# EAGLE design pic to fox (EAGLE 4.16)
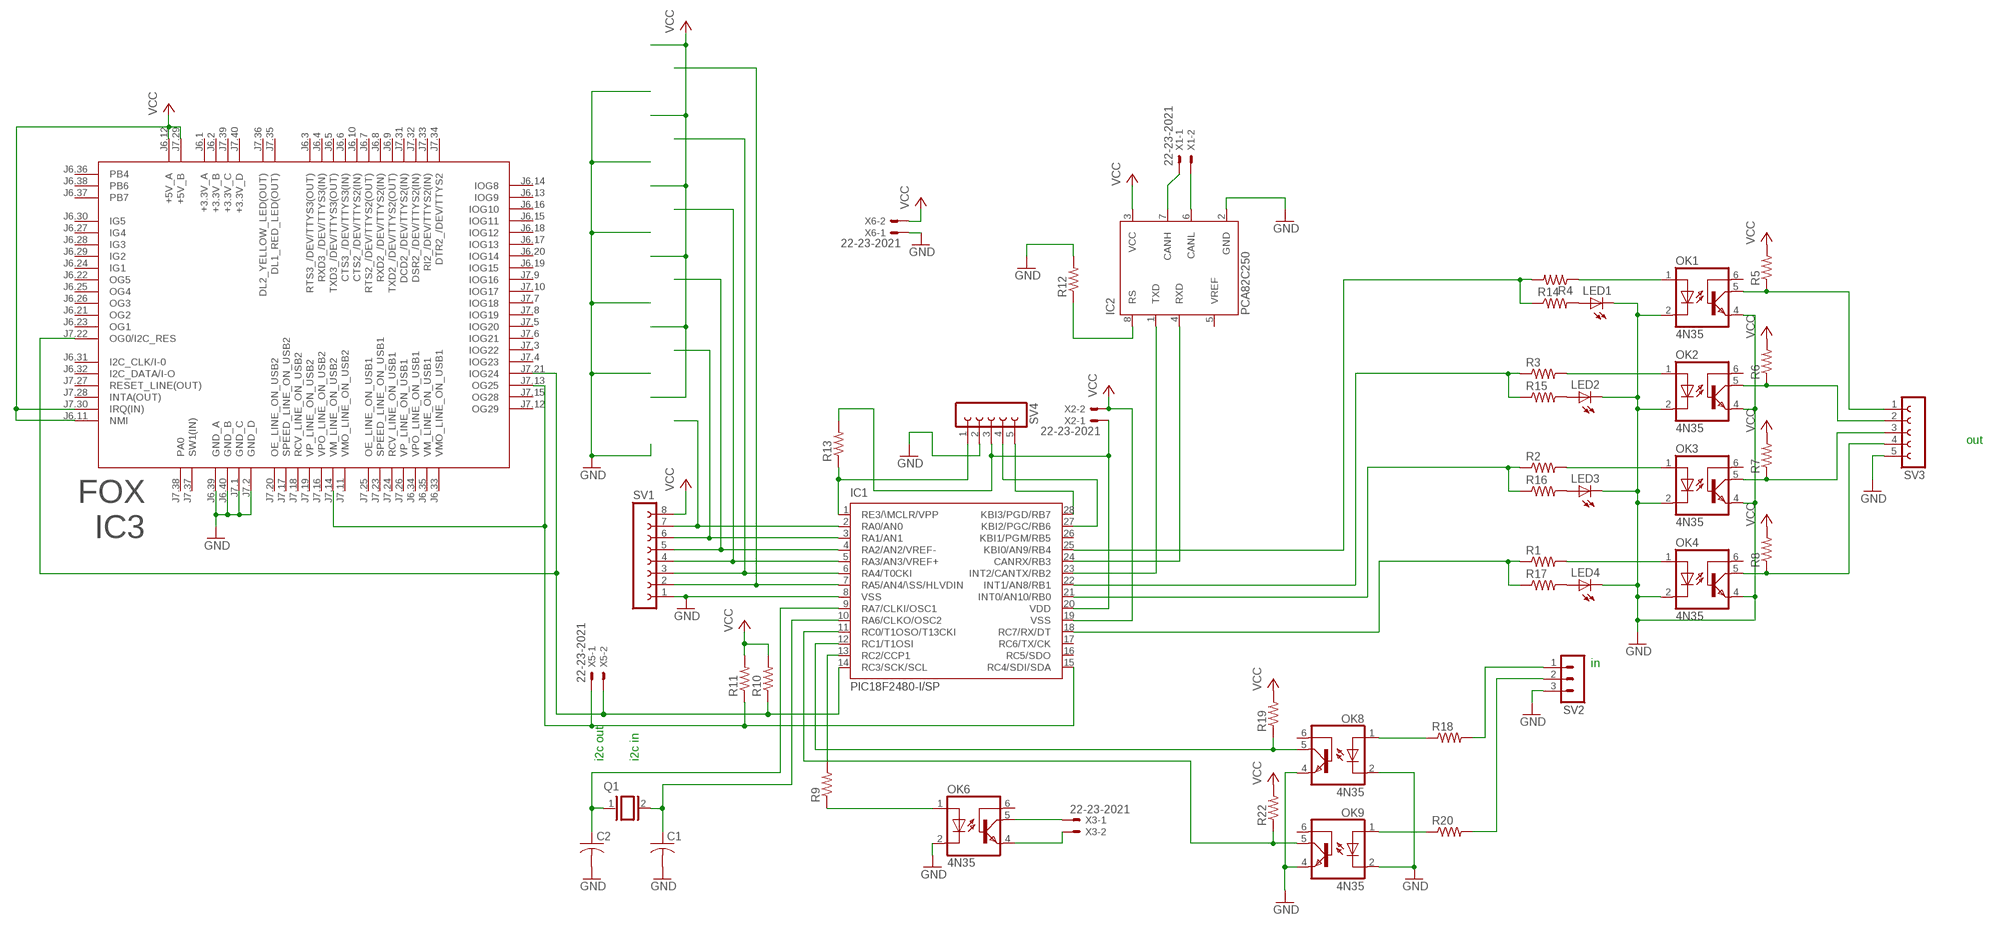
[diagram p0: schematic, sheet 1]

## Parts
C1  C-US025-030X050  [C025-030X050]
C2  C-US025-030X050  [C025-030X050]
IC1  PIC18F2480-I/SP  [DIL28-3]
IC2  PCA82C250  [DIL08]
IC3  FOX  [FOX]
LED1  LEDCHIP-LED0805  [CHIP-LED0805]
LED2  LEDCHIP-LED0805  [CHIP-LED0805]
LED3  LEDCHIP-LED0805  [CHIP-LED0805]
LED4  LEDCHIP-LED0805  [CHIP-LED0805]
OK1  4N35  [DIL06]
OK2  4N35  [DIL06]
OK3  4N35  [DIL06]
OK4  4N35  [DIL06]
OK6  4N35  [DIL06]
OK8  4N35  [DIL06]
OK9  4N35  [DIL06]
Q1  XTAL  [Q]
R1  R-US_0207/5V  [0207/5V]
R2  R-US_0207/2V  [0207/2V]
R3  R-US_0207/2V  [0207/2V]
R4  R-US_0207/10  [0207/10]
R5  R-US_0207/2V  [0207/2V]
R6  R-US_0207/12  [0207/12]
R7  R-US_0207/2V  [0207/2V]
R8  R-US_0207/2V  [0207/2V]
R9  R-US_0207/2V  [0207/2V]
R10  R-US_0207/2V  [0207/2V]
R11  R-US_0207/2V  [0207/2V]
R12  R-US_0207/10  [0207/10]
R13  R-US_0207/5V  [0207/5V]
R14  R-US_0207/10  [0207/10]
R15  R-US_0207/2V  [0207/2V]
R16  R-US_0207/2V  [0207/2V]
R17  R-US_0207/2V  [0207/2V]
R18  R-US_0207/10  [0207/10]
R19  R-US_0207/2V  [0207/2V]
R20  R-US_0207/10  [0207/10]
R22  R-US_0207/5V  [0207/5V]
SV1  FE08-1  [FE08]
SV2  MA03-1  [MA03-1]
SV3  FE05-1  [FE05-1]
SV4  FE05-1  [FE05-1]
X1  22-23-2021  [22-23-2021]
X2  22-23-2021  [22-23-2021]
X3  22-23-2021  [22-23-2021]
X5  22-23-2021  [22-23-2021]
X6  22-23-2021  [22-23-2021]

## Nets
GND: C1.2 C2.2 IC1.8(VSS) IC2.2(GND) IC3.J6.39(GND_A) IC3.J6.40(GND_B) IC3.J7.1(GND_C) IC3.J7.2(GND_D) LED1.C LED2.C LED3.C LED4.C OK1.2(C) OK1.4(EMI) OK2.2(C) OK2.4(EMI) OK3.2(C) OK3.4(EMI) OK4.2(C) OK4.4(EMI) OK6.2(C) OK8.2(C) OK8.4(EMI) OK9.2(C) OK9.4(EMI) R12.2 SV1.1 SV2.3 SV3.5 SV4.2 X6.1
N$1: IC1.2(RA0/AN0) SV1.7
N$2: IC1.3(RA1/AN1) SV1.6
N$3: IC1.4(RA2/AN2/VREF-) SV1.5
N$4: IC1.5(RA3/AN3/VREF+) SV1.4
N$5: IC1.6(RA4/T0CKI) SV1.3
N$6: OK4.1(A) R1.2
N$7: IC1.11(RC0/T1OSO/T13CKI) OK9.5(COL) R22.1
N$8: LED1.A R14.2
N$9: LED3.A R16.2
N$10: IC1.7(RA5/AN4/\SS/HLVDIN) SV1.2
N$11: IC1.15(RC4/SDI/SDA) IC3.J7.13(OG25) IC3.J7.14(VM_LINE_ON_USB2) R11.1 X5.1
N$12: IC1.14(RC3/SCK/SCL) IC3.J7.21(IOG24) IC3.J7.22(OG0/I2C_RES) R10.1 X5.2
N$13: OK3.1(A) R2.2
N$14: OK2.1(A) R3.2
N$15: OK1.1(A) R4.1
N$16: OK3.5(COL) R7.1 SV3.3
N$17: OK4.5(COL) R8.1 SV3.4
N$18: OK2.5(COL) R6.1 SV3.2
N$19: OK1.5(COL) R5.1 SV3.1
N$20: LED4.A R17.2
N$21: IC1.13(RC2/CCP1) R9.2
N$22: OK6.1(A) R9.1
N$23: IC1.23(INT2/CANTX/RB2) IC2.1(TXD)
N$24: C1.1 IC1.10(RA6/CLKO/OSC2) Q1.2
N$25: C2.1 IC1.9(RA7/CLKI/OSC1) Q1.1
N$26: LED2.A R15.2
N$27: IC1.12(RC1/T1OSI) OK8.5(COL) R19.1
N$29: IC1.24(CANRX/RB3) IC2.4(RXD)
N$31: IC2.6(CANL) X1.2
N$32: IC2.7(CANH) X1.1
N$33: IC2.8(RS) R12.1
N$37: IC1.1(RE3/\MCLR/VPP) R13.1 SV4.1
N$38: IC1.20(VDD) R13.2 SV4.3 X2.1
N$39: IC1.27(KBI2/PGC/RB6) SV4.4
N$40: OK8.1(A) R18.1
N$41: IC1.25(KBI0/AN9/RB4) R4.2 R14.1
N$42: IC1.22(INT1/AN8/RB1) R3.1 R15.1
N$43: IC1.21(INT0/AN10/RB0) R2.1 R16.1
N$44: IC1.18(RC7/RX/DT) R1.1 R17.1
N$45: OK9.1(A) R20.1
N$47: OK6.5(COL) X3.1
N$48: OK6.4(EMI) X3.2
N$52: R18.2 SV2.1
N$53: R20.2 SV2.2
N$54: IC1.28(KBI3/PGD/RB7) SV4.5
VCC: IC1.19(VSS) IC2.3(VCC) IC3.J6.11(NMI) IC3.J6.12(+5V_A) IC3.J7.29(+5V_B) IC3.J7.30(IRQ(IN)) R5.2 R6.2 R7.2 R8.2 R10.2 R11.2 R19.2 R22.2 SV1.8 X2.2 X6.2
Unconnected: IC1.16(RC5/SDO) IC1.17(RC6/TX/CK) IC1.26(KBI1/PGM/RB5) IC2.5(VREF) IC3.J6.1(+3.3V_A) IC3.J6.2(+3.3V_B) IC3.J6.3(RTS3_/DEV/TTYS3(OUT)) IC3.J6.4(RXD3_/DEV/TTYS3(IN)) IC3.J6.5(TXD3_/DEV/TTYS3(OUT)) IC3.J6.6(CTS3_/DEV/TTYS3(IN)) IC3.J6.7(RTS2_/DEV/TTYS2(OUT)) IC3.J6.8(RXD2_/DEV/TTYS2(IN)) IC3.J6.9(TXD2_/DEV/TTYS2(OUT)) IC3.J6.10(CTS2_/DEV/TTYS2(IN)) IC3.J6.13(IOG9) IC3.J6.14(IOG8) IC3.J6.15(IOG11) IC3.J6.16(IOG10) IC3.J6.17(IOG13) IC3.J6.18(IOG12) IC3.J6.19(IOG15) IC3.J6.20(IOG14) IC3.J6.21(OG2) IC3.J6.22(OG5) IC3.J6.23(OG1) IC3.J6.24(IG1) IC3.J6.25(OG4) IC3.J6.26(OG3) IC3.J6.27(IG4) IC3.J6.28(IG3) IC3.J6.29(IG2) IC3.J6.30(IG5) IC3.J6.31(I2C_CLK/I-0) IC3.J6.32(I2C_DATA/I-O) IC3.J6.33(VMO_LINE_ON_USB1) IC3.J6.34(VPO_LINE_ON_USB1) IC3.J6.35(VM_LINE_ON_USB1) IC3.J6.36(PB4) IC3.J6.37(PB7) IC3.J6.38(PB6) IC3.J7.3(IOG22) IC3.J7.4(IOG23) IC3.J7.5(IOG20) IC3.J7.6(IOG21) IC3.J7.7(IOG18) IC3.J7.8(IOG19) IC3.J7.9(IOG16) IC3.J7.10(IOG17) IC3.J7.11(VMO_LINE_ON_USB2) IC3.J7.12(OG29) IC3.J7.15(OG28) IC3.J7.16(VPO_LINE_ON_USB2) IC3.J7.17(SPEED_LINE_ON_USB2) IC3.J7.18(RCV_LINE_ON_USB2) IC3.J7.19(VP_LINE_ON_USB2) IC3.J7.20(OE_LINE_ON_USB2) IC3.J7.23(SPEED_LINE_ON_USB1) IC3.J7.24(RCV_LINE_ON_USB1) IC3.J7.25(OE_LINE_ON_USB1) IC3.J7.26(VP_LINE_ON_USB1) IC3.J7.27(RESET_LINE(OUT)) IC3.J7.28(INTA(OUT)) IC3.J7.31(DCD2_/DEV/TTYS2(IN)) IC3.J7.32(DSR2_/DEV/TTYS2(IN)) IC3.J7.33(RI2_/DEV/TTYS2(IN)) IC3.J7.34(DTR2_/DEV/TTYS2) IC3.J7.35(DL1_RED_LED(OUT)) IC3.J7.36(DL2_YELLOW_LED(OUT)) IC3.J7.37(SW1(IN)) IC3.J7.38(PA0) IC3.J7.39(+3.3V_C) IC3.J7.40(+3.3V_D) OK1.6(BAS) OK2.6(BAS) OK3.6(BAS) OK4.6(BAS) OK6.6(BAS) OK8.6(BAS) OK9.6(BAS)

## Notes on the sheet
- out
- in
- i2c out | i2c in

## Library data of the parts
C1 C2 = rcl:C-US: CAPACITOR, American symbol
IC1 = microchip:PIC18F2*80: 28-Pin Enhanced Flash Microcontrollers with ECAN(TM) Technology 10-Bit A/D and nanoWatt Technology Source: http://www.microchip.com .. 39637a.pdf
IC2 = micro-philips:PCA82C250: CAN CONTROLLER INTERFACE
IC3 = aggiunte:FOX: FOXBOARD Un sistema linux embedded completo www.acmesystem.it
LED1-LED4 = led:LED: LED OSRAM: - CHIPLED LG R971, LG N971, LY N971, LG Q971, LY Q971, LO R971, LY R971 LH N974, LH R974 LS Q976, LO Q976, LY Q976 LO Q996 - Hyper CHIPLED LW Q18S LB Q993, LB Q99A, LB R99A - SideLED LS A670, LO A670, LY A670, LG A670, LP A670 LB A673, LV A673, LT A673, LW A673 LH A674 LY A675 LS A676, LA A676, LO A676, LY A676, LW A676 LS A679, LY A679, LG A679 - Hyper Micro SIDELED® LS Y876, LA Y876, LO Y876, LY Y876 LT Y87S - SmartLED LW L88C, LW L88S LB L89C, LB L89S, LG L890 LS L89K, LO L89K, LY L89K LS L896, LA L896, LO L896, LY L896 - TOPLED LS T670, LO T670, LY T670, LG T670, LP T670 LSG T670, LSP T670, LSY T670, LOP T670, LYG T670 LG T671, LOG T671, LSG T671 LB T673, LV T673, LT T673, LW T673 LH T674 LS T676, LA T676, LO T676, LY T676, LB T676, LH T676, LSB T676, LW T676 LB T67C, LV T67C, LT T67C, LS T67K, LO T67K, LY T67K, LW E67C LS E67B, LA E67B, LO E67B, LY E67B, LB E67C, LV E67C, LT E67C LW T67C LS T679, LY T679, LG T679 LS T770, LO T770, LY T770, LG T770, LP T770 LB T773, LV T773, LT T773, LW T773 LH T774 LS E675, LA E675, LY E675, LS T675 LS T776, LA T776, LO T776, LY T776, LB T776 LHGB T686 LT T68C, LB T68C - Hyper Mini TOPLED® LB M676 - Mini TOPLED Santana® LG M470 LS M47K, LO M47K, LY M47K Source: http://www.osram.convergy.de - LUMILED® LXK2-PW12-R00, LXK2-PW12-S00, LXK2-PW14-U00, LXK2-PW14-V00 LXK2-PM12-R00, LXK2-PM12-S00, LXK2-PM14-U00 LXK2-PE12-Q00, LXK2-PE12-R00, LXK2-PE12-S00, LXK2-PE14-T00, LXK2-PE14-U00 LXK2-PB12-K00, LXK2-PB12-L00, LXK2-PB12-M00, LXK2-PB14-N00, LXK2-PB14-P00, LXK2-PB14-Q00 LXK2-PR12-L00, LXK2-PR12-M00, LXK2-PR14-Q00, LXK2-PR14-R00 LXK2-PD12-Q00, LXK2-PD12-R00, LXK2-PD12-S00 LXK2-PH12-R00, LXK2-PH12-S00 LXK2-PL12-P00, LXK2-PL12-Q00, LXK2-PL12-R00 Source: www.luxeon.com
OK1-OK4 OK6 OK8 OK9 = optocoupler:4N35: MOTOROLA OPTO COUPLER
Q1 = special:XTAL: CRYSTAL
R1-R20 R22 = rcl:R-US_: RESISTOR, American symbol
SV1 = con-lsta:FE08-1: FEMALE HEADER
SV2 = con-lstb:MA03-1: PIN HEADER
SV3 SV4 = con-lsta:FE05-1: FEMALE HEADER
X1-X3 X5 X6 = con-molex:22-23-2021: .100" (2.54mm) Center Header - 2 Pin

## Board
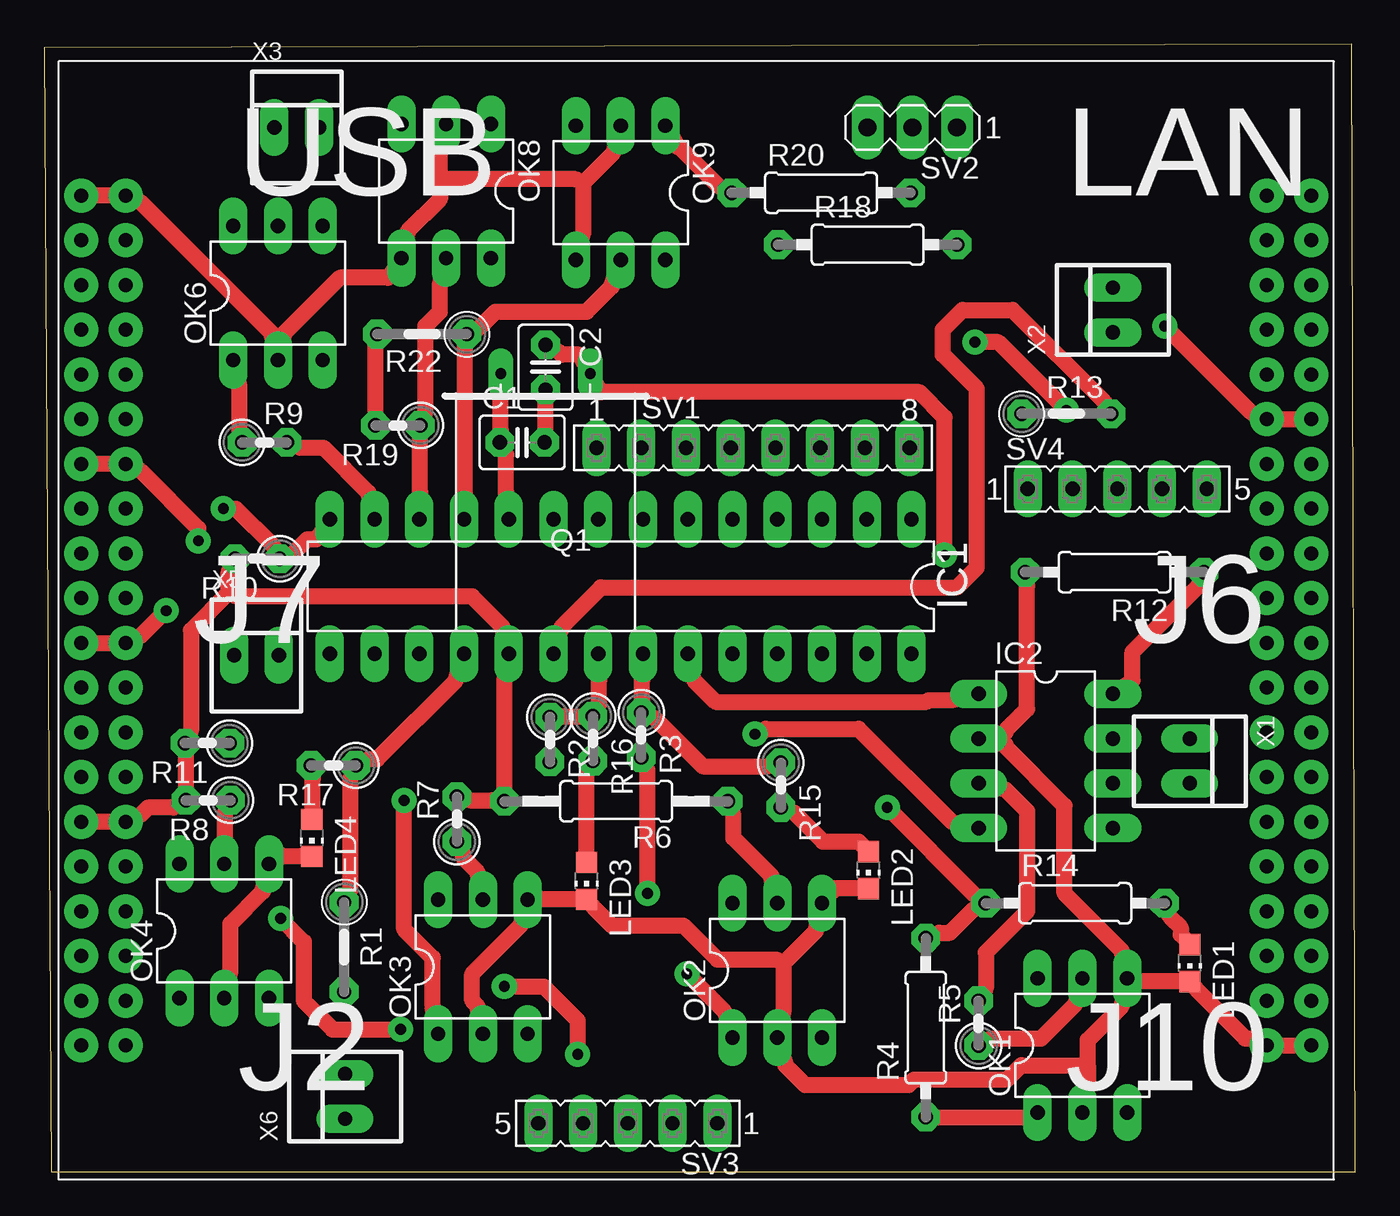
[diagram p1: board, top side]
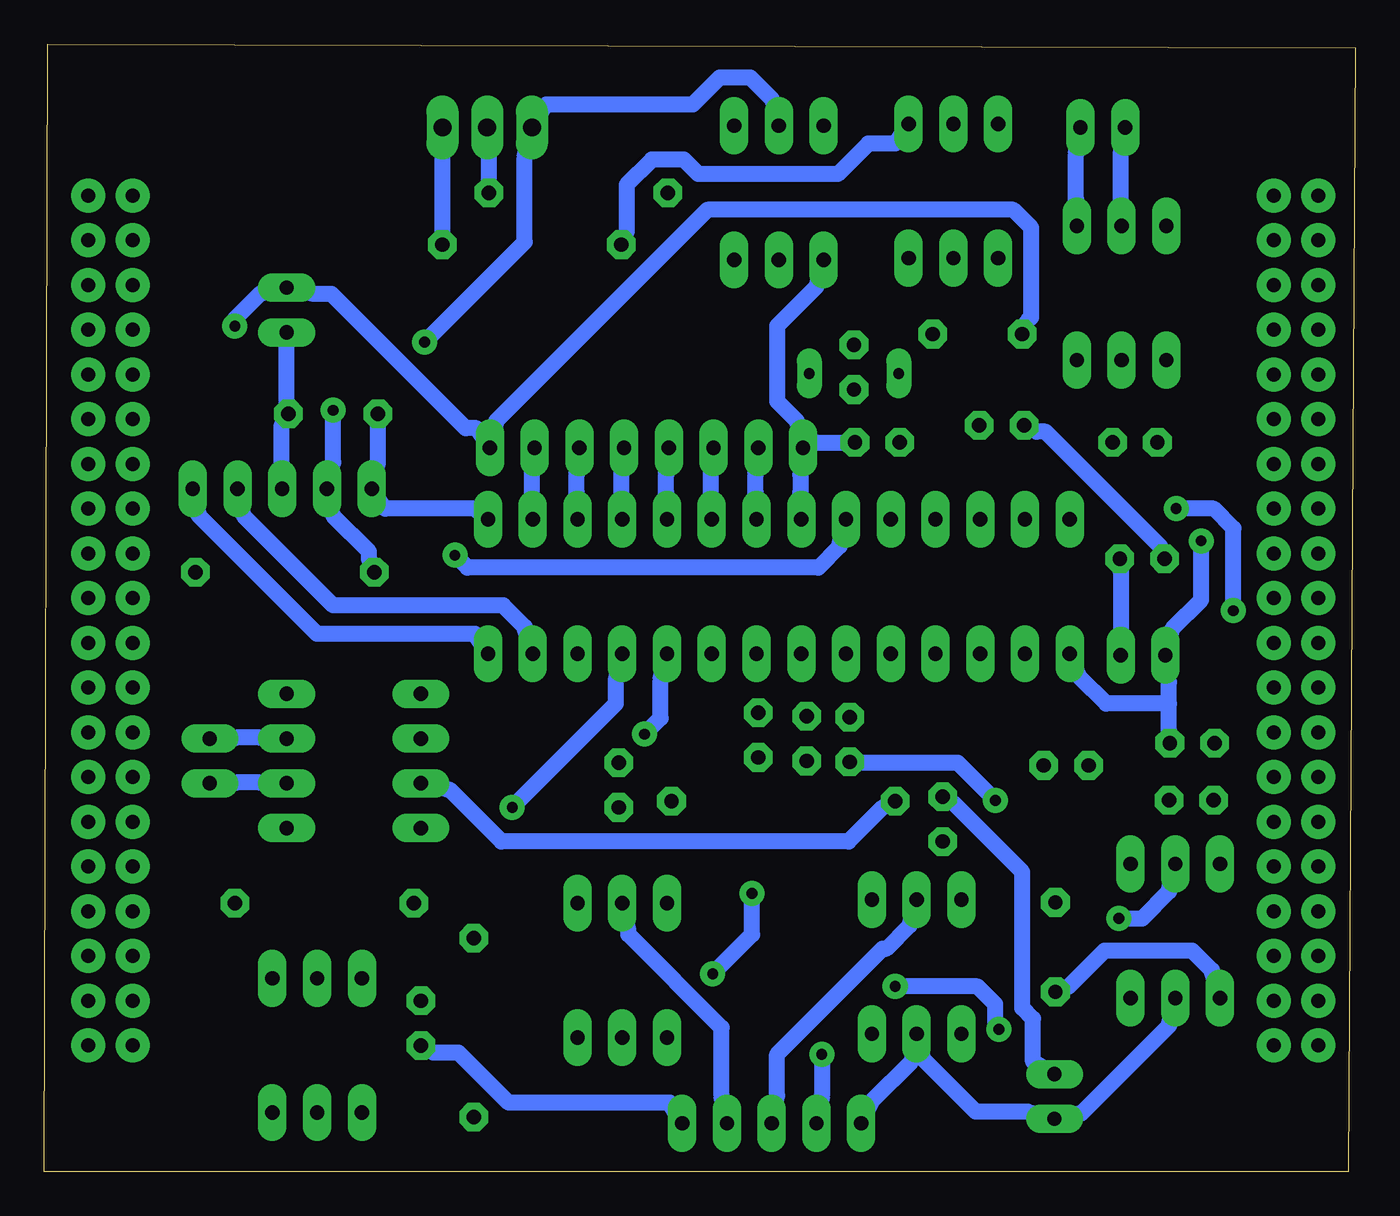
[diagram p2: board, bottom side, seen from below]

Size 74.45 x 64.03 mm. Coordinates in mm from the lower left corner, seen from the top.
Outline: 0.41,0 74.45,0 74.25,64.03 0,63.83 0.41,0
Copper layers (1*16): Top 0.035mm / dielectric 1.5mm / Bottom 0.035mm
Design rules "mio2": minimum track width 36mil, minimum drill 24mil, track to track 24mil, track to pad 24mil, pad to pad 24mil, via to via 24mil, smd to smd 24mil, copper to edge 24mil, drill to drill 8mil, minimum pad ring 16mil, minimum via ring 16mil, stop-mask expansion 4mil, vias tented up to drill 0mil, thermal gap 10mil
tRestrict: area 27.2,1.1 to 39.2,4.3; area 54.5,37.2 to 67.1,40.5; area 63.4,21.2 to 66.5,25.5; area 30.3,39.5 to 50,42.9; area 58.9,47 to 62.2,51.1; area 45.7,57.4 to 52.9,61.2; area 12.2,57.8 to 16.5,61; area 10,27.7 to 14,30.9; area 15.5,2.3 to 18.7,6.4

### Footprints (pad centres in the part's own frame; a part is rotated, then mirrored left to right if it is on the bottom)
C025-030X050 = drill 0.813 octagon: 1 -1.27,0; 2 1.27,0
DIL28-3 = drill 0.813 long: 1 -16.51,-3.81; 2 -13.97,-3.81; 3 -11.43,-3.81; 4 -8.89,-3.81; 5 -6.35,-3.81; 6 -3.81,-3.81; 7 -1.27,-3.81; 8 1.27,-3.81; 9 3.81,-3.81; 10 6.35,-3.81; 11 8.89,-3.81; 12 11.43,-3.81; 13 13.97,-3.81; 14 16.51,-3.81; 15 16.51,3.81; 16 13.97,3.81; 17 11.43,3.81; 18 8.89,3.81; 19 6.35,3.81; 20 3.81,3.81; 21 1.27,3.81; 22 -1.27,3.81; 23 -3.81,3.81; 24 -6.35,3.81; 25 -8.89,3.81; 26 -11.43,3.81; 27 -13.97,3.81; 28 -16.51,3.81
DIL08 = drill 0.813 long: 1 -3.81,-3.81; 2 -1.27,-3.81; 3 1.27,-3.81; 4 3.81,-3.81; 5 3.81,3.81; 6 1.27,3.81; 7 -1.27,3.81; 8 -3.81,3.81
FOX = drill 0.8 pad 1.93 round: J6.1 67.31,0; J6.2 69.85,0; J6.3 67.31,-2.54; J6.4 69.85,-2.54; J6.5 67.31,-5.08; J6.6 69.85,-5.08; J6.7 67.31,-7.62; J6.8 69.85,-7.62; J6.9 67.31,-10.16; J6.10 69.85,-10.16; J6.11 67.31,-12.7; J6.12 69.85,-12.7; J6.13 67.31,-15.24; J6.14 69.85,-15.24; J6.15 67.31,-17.78; J6.16 69.85,-17.78; J6.17 67.31,-20.32; J6.18 69.85,-20.32; J6.19 67.31,-22.86; J6.20 69.85,-22.86; J6.21 67.31,-25.4; J6.22 69.85,-25.4; J6.23 67.31,-27.94; J6.24 69.85,-27.94; J6.25 67.31,-30.48; J6.26 69.85,-30.48; J6.27 67.31,-33.02; J6.28 69.85,-33.02; J6.29 67.31,-35.56; J6.30 69.85,-35.56; J6.31 67.31,-38.1; J6.32 69.85,-38.1; J6.33 67.31,-40.64; J6.34 69.85,-40.64; J6.35 67.31,-43.18; J6.36 69.85,-43.18; J6.37 67.31,-45.72; J6.38 69.85,-45.72; J6.39 67.31,-48.26; J6.40 69.85,-48.26; J7.1 0,0; J7.2 2.54,0; J7.3 0,-2.54; J7.4 2.54,-2.54; J7.5 0,-5.08; J7.6 2.54,-5.08; J7.7 0,-7.62; J7.8 2.54,-7.62; J7.9 0,-10.16; J7.10 2.54,-10.16; J7.11 0,-12.7; J7.12 2.54,-12.7; J7.13 0,-15.24; J7.14 2.54,-15.24; J7.15 0,-17.78; J7.16 2.54,-17.78; J7.17 0,-20.32; J7.18 2.54,-20.32; J7.19 0,-22.86; J7.20 2.54,-22.86; J7.21 0,-25.4; J7.22 2.54,-25.4; J7.23 0,-27.94; J7.24 2.54,-27.94; J7.25 0,-30.48; J7.26 2.54,-30.48; J7.27 0,-33.02; J7.28 2.54,-33.02; J7.29 0,-35.56; J7.30 2.54,-35.56; J7.31 0,-38.1; J7.32 2.54,-38.1; J7.33 0,-40.64; J7.34 2.54,-40.64; J7.35 0,-43.18; J7.36 2.54,-43.18; J7.37 0,-45.72; J7.38 2.54,-45.72; J7.39 0,-48.26; J7.40 2.54,-48.26
CHIP-LED0805 = smd 1.2 x 1.2: A 0,-1.05; C 0,1.05
DIL06 = drill 0.813 long: 1 -2.54,-3.81; 2 0,-3.81; 3 2.54,-3.81; 4 2.54,3.81; 5 0,3.81; 6 -2.54,3.81
Q = drill 0.61 long: 1 -2.54,-7.62; 2 2.54,-7.62
0207/5V = drill 0.813 octagon: 1 -2.54,0; 2 2.54,0
0207/2V = drill 0.813 octagon: 1 -1.27,0; 2 1.27,0
0207/10 = drill 0.813 octagon: 1 -5.08,0; 2 5.08,0
0207/12 = drill 0.813 octagon: 1 -6.35,0; 2 6.35,0
FE08 = drill 0.813 long: 1 -8.89,0; 2 -6.35,0; 3 -3.81,0; 4 -1.27,0; 5 1.27,0; 6 3.81,0; 7 6.35,0; 8 8.89,0
MA03-1 = drill 1.016 long: 1 -2.54,0; 2 0,0; 3 2.54,0
FE05-1 = drill 0.813 long: 1 -5.08,0; 2 -2.54,0; 3 0,0; 4 2.54,0; 5 5.08,0
22-23-2021 = drill 0.813 long: 1 -1.27,0; 2 1.27,0

### Placement (x,y rotation side)
C1  27.15,41.41 0 top
C2  28.47,45.68 270 top
IC1  32.74,33.24 180 top
IC2  56.87,23.33 270 top
IC3  2.1,55.44 0 top
LED1  65.04,11.85 180 top
LED2  46.81,17.13 180 top
LED3  30.81,16.52 180 top
LED4  15.21,18.96 180 top
OK1  58.95,7.18 0 top
OK2  41.63,11.44 0 top
OK3  24.91,11.65 0 top
OK4  10.23,13.68 0 top
OK6  13.28,49.9 0 top
OK8  22.83,55.69 180 top
OK9  32.74,55.59 180 top
Q1  28.47,37.71 180 top
R1  17.04,12.76 270 top
R2  28.72,24.55 270 top
R3  33.9,24.8 270 top
R4  50.06,8.19 90 top
R5  53.06,8.45 90 top
R6  32.48,21.04 180 top
R7  23.44,20.03 90 top
R8  9.32,21.09 180 top
R9  12.52,41.41 0 top
R10  12.11,34.81 180 top
R11  9.27,24.35 180 top
R12  60.78,34.05 180 top
R13  58.03,43.04 0 top
R14  58.54,15.25 0 top
R15  41.83,21.96 270 top
R16  31.16,24.6 270 top
R17  16.43,23.08 180 top
R18  46.76,52.64 0 top
R19  20.09,42.38 180 top
R20  44.11,55.59 0 top
R22  21.46,47.56 180 top
SV1  40.25,41.11 0 top
SV2  49.3,59.3 180 top
SV3  33.14,2.76 180 top
SV4  60.93,38.77 0 top
X1  65.04,23.33 270 top
X2  60.68,48.93 90 top
X3  14.35,59.3 0 top
X5  12.06,29.32 0 top
X6  17.09,4.28 90 top

### Tracks (layer width: path | path; a pad name or v marks a point on that pad's centre or on a via)
GND  (via drill 0.61)
  Top 0.914: IC3.J7.1 IC3.J7.2 5.51,55.03 12.92,47.61 OK6.2 13.64,47.61 16.78,50.76 19.53,50.76 OK8.4 20.65,53.4 22.47,55.23 22.47,56.35 | 22.47,56.35 22.47,57.98 OK8.2 | C2.2 28.47,42.13 C1.2 | 30.6,56.15 30.6,53.3 OK9.4 | 30.6,56.15 32.33,57.87 OK9.2 | 22.47,56.35 30.2,56.35 30.6,56.15 | IC3.J6.40 IC3.J6.39 68.5,7.58 68.19,7.58 65.55,10.22 LED1.C 64.54,10.83 62.2,10.83 OK1.4 | v52.85,47.1 54.17,47.1 v58.03,43.24 | LED4.C 14.65,17.95 13.53,17.95 OK4.4 12.42,15.91 10.59,14.08 10.59,11.44 OK4.2 | LED2.C 46.25,16.12 44.93,16.12 OK2.4 43.81,13.68 41.98,11.85 | 41.98,11.85 41.98,9.21 OK2.2 42.08,6.16 42.08,6.06 43.2,4.94 49.09,4.94 49.4,5.25 54.68,5.25 55.49,6.06 59.25,6.06 | OK3.2 24.61,9.41 24.3,9.72 24.3,11.24 27.05,13.98 OK3.4 28.16,15.51 30.3,15.51 LED3.C 31.31,14.9 32.23,13.98 36.29,13.98 38.22,12.05 41.58,12.05 41.98,11.85 | R12.2 55.8,33.29 55.8,26.28 54.58,25.06 54.58,24.96 IC2.2 54.58,24.24 54.58,24.14 57.93,20.79 57.93,15.81 61.18,12.56 OK1.4 | 59.25,6.06 59.25,7.48 61.18,9.41 OK1.4 | 59.25,6.06 59.25,4.94 OK1.2
  Bottom 0.914: C1.2 30.6,41.41 SV1.1 | IC1.8 31.52,38.57 31.52,39.59 SV1.1 | OK9.2 33.14,60.92 34.36,62.14 36.09,62.14 37.61,60.62 45.94,60.62 SV2.3 47.16,57.57 47.16,52.79 v52.85,47.1 | SV1.1 31.72,42.63 32.84,43.75 32.84,48.02 30.6,50.25 OK9.4 | R12.2 56,34.81 56,35.22 58.03,37.25 SV4.2 58.03,40.3 v58.03,43.24 | OK4.2 10.59,8.29 15.57,3.31 X6.1 18.61,3.42 21.56,3.42 24.51,6.36 OK3.2 25.22,6.26 27.45,4.03 SV3.5
N$1
  Bottom 0.914: IC1.2 46.76,38.57 46.76,39.59 SV1.7
N$2
  Bottom 0.914: IC1.3 44.22,38.57 44.22,39.59 SV1.6
N$3
  Bottom 0.914: IC1.4 41.68,38.57 41.68,39.59 SV1.5
N$4
  Bottom 0.914: IC1.5 39.14,38.57 39.14,39.59 SV1.4
N$5
  Bottom 0.914: IC1.6 36.6,38.57 36.6,39.59 SV1.3
N$6
  Bottom 0.914: OK4.1 8.15,11.34 8.15,11.44 9.27,12.56 14.24,12.56 16.28,10.53 R1.2
N$7
  Top 0.914: IC1.11 23.9,38.57 23.9,46.8 R22.1 24.71,47.92 25.62,48.83 30.81,48.83 32.23,50.25 32.23,50.36 OK9.5
N$8
  Top 0.914: LED1.A 64.54,13.47 64.54,13.88 63.93,14.49 R14.2
N$9
  Top 0.914: LED3.A 30.81,22.62 R16.2
N$10
  Bottom 0.914: IC1.7 34.06,38.57 34.06,39.59 SV1.2
N$11  (via drill 0.61)
  Top 0.914: IC3.J7.13 IC3.J7.14 5.51,39.79 8.76,36.54 v8.76,35.83
  Bottom 0.914: 10.59,26.58 10.59,27.8 X5.1 10.38,30.85 8.76,32.47 v8.76,35.83 | 10.59,26.58 10.59,25.06 R11.1 | IC1.15 15.67,28.11 14.14,26.58 10.59,26.58
N$12  (via drill 0.61)
  Top 0.914: IC3.J7.21 IC3.J7.22 5.51,30.44 v6.93,31.86 | IC1.14 15.46,35.93 14.96,35.93 14.14,35.12 R10.1 13.03,35.52 10.89,37.66 v10.18,37.66
  Bottom 0.914: R10.1 13.33,34.1 X5.2 | v10.18,37.66 8.05,37.66 6.93,36.54 v6.93,31.86
N$13  (via drill 0.61)
  Top 0.914: v20.44,21.09 20.44,13.78 22.07,12.15 22.07,9.41 OK3.1
  Bottom 0.914: v20.44,21.09 22.58,23.23 27.96,23.23 R2.2
N$14  (via drill 0.61)
  Top 0.914: v34.26,15.81 34.26,22.82 R3.2 | v36.5,11.24 38.63,9.11 OK2.1
  Bottom 0.914: v34.26,15.81 34.26,13.47 v36.5,11.24
N$15
  Top 0.914: R4.1 55.7,3.11 OK1.1
N$16
  Top 0.914: R7.1 23.8,18.05 23.8,17.84 24.61,17.03 OK3.5
  Bottom 0.914: SV3.3 32.84,4.33 32.84,6.67 26.84,12.66 26.64,12.66 25.32,13.98 OK3.5
N$17  (via drill 0.61)
  Top 0.914: OK4.5 10.28,19.06 10.28,20.38 R8.1 | v30.3,6.67 30.3,8.6 28.37,10.53 v26.13,10.53 | v20.24,8.09 16.38,8.09 14.75,9.72 14.75,13.07 v13.43,14.39
  Bottom 0.914: v30.3,6.67 30.3,4.33 SV3.4 | v26.13,10.53 21.46,10.53 20.44,9.51 20.44,8.29 v20.24,8.09 | v13.43,14.39 12.11,14.39 10.59,15.91 OK4.5
N$18
  Top 0.914: R6.1 39.14,20.28 39.14,18.96 41.27,16.83 OK2.5
  Bottom 0.914: SV3.2 35.99,4.33 35.99,8.19 41.27,13.47 41.27,13.68 OK2.5
N$19
  Top 0.914: OK1.5 58.54,9.51 56.61,7.58 53.77,7.58 R5.1
  Bottom 0.914: SV3.1 38.93,3.92 48.08,3.92 50.92,6.77 52.34,6.77 R5.1
N$20
  Top 0.914: LED4.A 15.26,20.59 15.26,22.31 R17.2
N$21
  Top 0.914: R9.2 14.55,41.11 15.87,41.11 18.41,38.57 IC1.13
N$22
  Top 0.914: R9.1 11.1,42.13 11.1,44.56 OK6.1
N$23
  Top 0.914: IC2.1 51.53,26.78 50.21,26.78 50.11,26.68 38.12,26.68 36.9,27.9 IC1.23
N$24
  Top 0.914: Q1.2 25.93,42.13 C1.1 26.23,40.7 26.23,38.57 IC1.10
N$25  (via drill 0.61)
  Top 0.914: C2.1 29.18,46.6 29.38,46.39 30.4,46.39 Q1.1 31.62,44.26 49.7,44.26 51.13,42.84 v51.13,35.01
  Bottom 0.914: v51.13,35.01 50.41,34.3 30.5,34.3 29.28,35.52 IC1.9
N$26
  Top 0.914: LED2.A 46.25,18.76 44.22,18.76 42.59,20.38 R15.2
N$27
  Top 0.914: IC1.12 21.36,38.57 R19.1 21.66,43.14 21.66,48.02 22.47,48.83 22.47,50.36 OK8.5
N$29  (via drill 0.61)
  Top 0.914: v40.36,24.85 40.66,24.85 40.97,25.16 46.25,25.16 51.53,19.88 IC2.4
  Bottom 0.914: v40.36,24.85 39.44,25.77 39.44,27.9 IC1.24
N$31
  Bottom 0.914: IC2.6 62.2,22.11 63.52,22.11 X1.2
N$32
  Bottom 0.914: IC2.7 62.2,24.65 63.52,24.65 X1.1
N$33
  Top 0.914: IC2.8 61.79,27.9 61.79,29.53 65.55,33.29 R12.1
N$37
  Bottom 0.914: IC1.1 50.01,37.66 55.09,37.66 SV4.1 55.49,40.3 R13.1
N$38
  Top 0.914: IC1.20 29.38,30.85 29.38,30.95 31.62,33.19 51.84,33.19 52.95,34.3 52.95,44.46 51.02,46.39 51.02,47.82 52.14,48.93 54.99,48.93 60.17,43.75 R13.2
  Bottom 0.914: SV4.3 60.98,40.3 60.98,42.33 R13.2 60.68,43.75 X2.1
N$39
  Bottom 0.914: IC1.27 47.16,30.85 47.16,30.95 48.38,32.17 58.03,32.17 63.11,37.25 SV4.4
N$40
  Bottom 0.914: OK8.1 26.13,58.38 27.66,58.38 29.38,56.65 37.31,56.65 38.12,57.47 39.95,57.47 41.37,56.05 41.37,53.4 R18.1
N$41  (via drill 0.61)
  Top 0.914: R4.2 50.82,13.58 51.43,13.58 52.75,14.9 R14.1 52.85,15.71 v47.87,20.69
  Bottom 0.914: v47.87,20.69 41.98,26.58 41.98,27.9 IC1.25
N$42
  Top 0.914: IC1.22 33.96,27.9 33.96,26.78 R3.1 34.67,25.77 37.41,23.03 41.07,23.03 R15.1
N$43
  Top 0.914: R2.1 29.48,25.87 R16.1 31.52,26.58 31.52,27.9 IC1.21
N$44
  Top 0.914: R1.1 17.39,16.01 17.39,22.31 R17.1 18.41,23.43 18.92,23.43 23.39,27.9 23.39,28 IC1.18
N$45
  Top 0.914: OK9.1 35.99,58.18 36.09,58.18 38.32,55.94 R20.1
N$47
  Bottom 0.914: OK6.5 13.33,55.23 13.33,57.77 X3.1
N$48
  Bottom 0.914: OK6.4 15.87,55.23 15.87,57.77 X3.2
N$52
  Bottom 0.914: R18.2 SV2.1
N$53
  Bottom 0.914: R20.2 49.2,57.57 SV2.2
N$54
  Bottom 0.914: IC1.28 50.01,30.54 58.95,30.54 65.65,37.25 SV4.5
VCC  (via drill 0.61)
  Top 0.914: IC3.J6.12 IC3.J6.11 68.5,43.14 v63.62,48.02 | R19.2 18.82,46.8 R22.2 | IC3.J7.29 IC3.J7.30 5.51,20.28 5.91,20.69 7.34,20.69 R8.2 8.05,23.63 R11.2 8.35,25.06 8.35,30.75 10.49,32.88 | 10.49,32.88 10.49,34.1 R10.2 | 10.49,32.88 10.89,32.68 24.3,32.68 26.03,30.95 IC1.19 26.13,27.9 R6.2 25.42,21.09 24.2,21.09 R7.2 | R5.2 53.46,10.43 53.46,12.46 55.8,14.8 55.8,20.49 54.58,21.7 IC2.3
  Bottom 0.914: v63.62,48.02 63.62,48.43 62.2,49.85 X2.2 59.15,49.85 58.14,49.85 50.52,42.23 49.91,42.23 SV1.8 48.79,42.63 36.8,54.62 19.43,54.62 18.41,53.61 18.41,48.53 18.61,48.32 R22.2 | R19.2 18.11,42.02 17.6,42.02 11.1,35.52 R10.2 | X6.2 18.31,6.26 18.31,8.7 18.92,9.31 18.92,17.03 22.78,20.89 R7.2 | IC2.3 51.53,21.7 51.43,21.7 48.48,18.76 28.77,18.76 26.84,20.69 R6.2